# EAGLE schematic Lightbox schematic_29OCT (EAGLE 9.2.0)
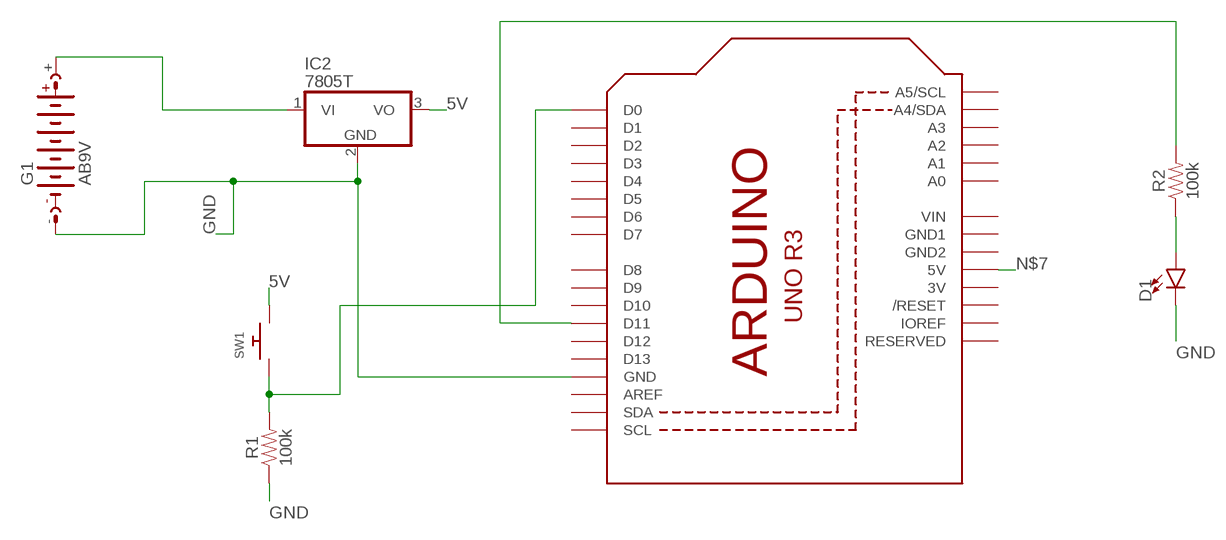
[diagram p0: schematic, sheet 1]

## Parts
D1  LED3MM  [LED_3MM]
G1  AB9V  [AB9V]
IC2  7805T  [TO220H]
R1  100k  100KOHM-HORIZ-1/4W-1%  [AXIAL-0.3]
R2  100k  100KOHM-HORIZ-1/4W-1%  [AXIAL-0.3]
SW1  SWITCH_PUSHBUTTONSOFTTOUCHSMD_SJ  [PUSHBUTTON_SMD_SJ]
U1  ARDUINOR3-DIMENSION  [ARDUINOR3]

## Nets
5V: IC2.3(VO) SW1.P$2
GND: D1.K(C) G1.- IC2.2(GND) R1.P$1 U1.GND
N$1: G1.+ IC2.1(VI)
N$2: R1.P$2 SW1.P$1 U1.D0
N$3: R2.P$2 U1.D11
N$4: D1.A R2.P$1
N$7: U1.5V
Unconnected: U1.A0 U1.A1 U1.A2 U1.A3 U1.A4(A4/SDA) U1.A5(A5/SCL) U1.AREF U1.D1 U1.D2 U1.D3 U1.D4 U1.D5 U1.D6 U1.D7 U1.D8 U1.D9 U1.D10 U1.D12 U1.D13 U1.IOREF U1.RESERVED U1.RESET(/RESET) U1.SCL U1.SDA

## Power pins joined to a net without a drawn wire
3V: U1.3V
GND1: U1.GND1
GND2: U1.GND2
VIN: U1.VIN

## Library data of the parts
D1 = SparkFun-LED:LED: LED (Generic) Standard schematic elements and footprints for 5mm, 3mm, 1206, and 0603 sized LEDs. Generic LEDs with no color specified.; PROD_ID: DIO-08794
G1 = battery:AB9V: 9-V BATTERY CLIP
IC2 = linear:78*: Positive VOLTAGE REGULATOR Source: http://cache.national.com/ds/LM/LM78L05.pdf http://www.fairchildsemi.com/ds/LM/LM7805.pdf
R1 R2 = SparkFun-Resistors:100KOHM: 100kΩ resistor A resistor is a passive two-terminal electrical component that implements electrical resistance as a circuit element. Resistors act to reduce current flow, and, at the same time, act to lower voltage levels within circuits. - Wikipedia; PROD_ID: RES-12184
SW1 = adafruit:SWITCH_PUSHBUTTON: Buttons SOFTTOUCHSMD_SJ - Soft touch temporary push button (Super Junk Akihabara) Compatible with SKPMANE010 [Mouser: 688-SKPMAN] C&K_KSS = Digikey: KSS221GLFS
U1 = adafruit:ARDUINOR3: This is a new object for the new Arduino R3 - with extra pins that you may want to use (such as IOref, and duplicated A4/A5